# Altium project PROC054D_MMW_CAS_RF_EVM.PrjPcb (part 1 of 9)
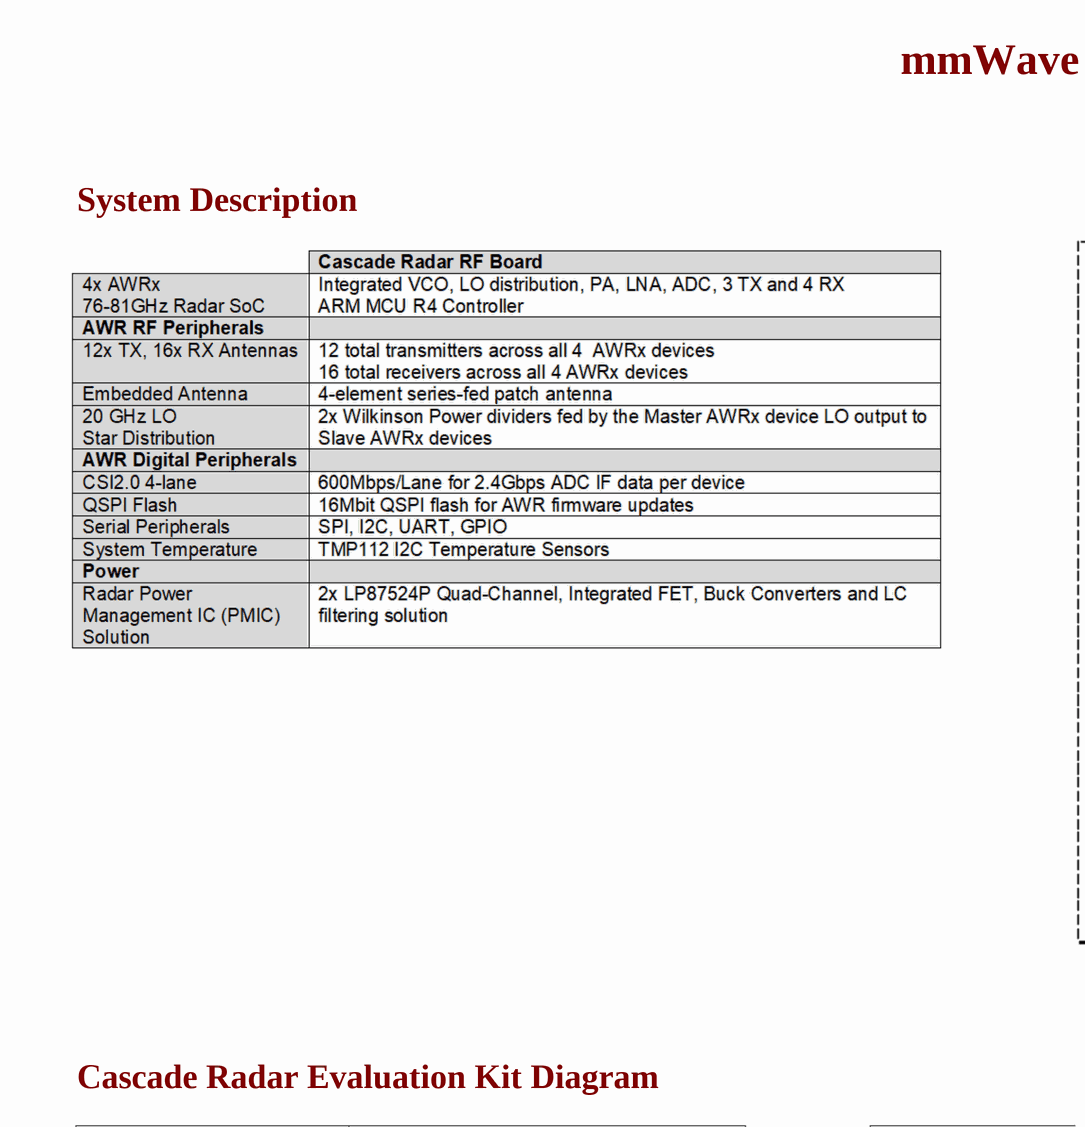
[diagram p0: PROC054D_Coversheet.SchDoc, top left]
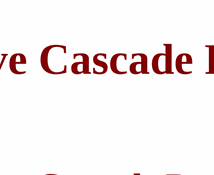
[diagram p1: PROC054D_Coversheet.SchDoc, top right]
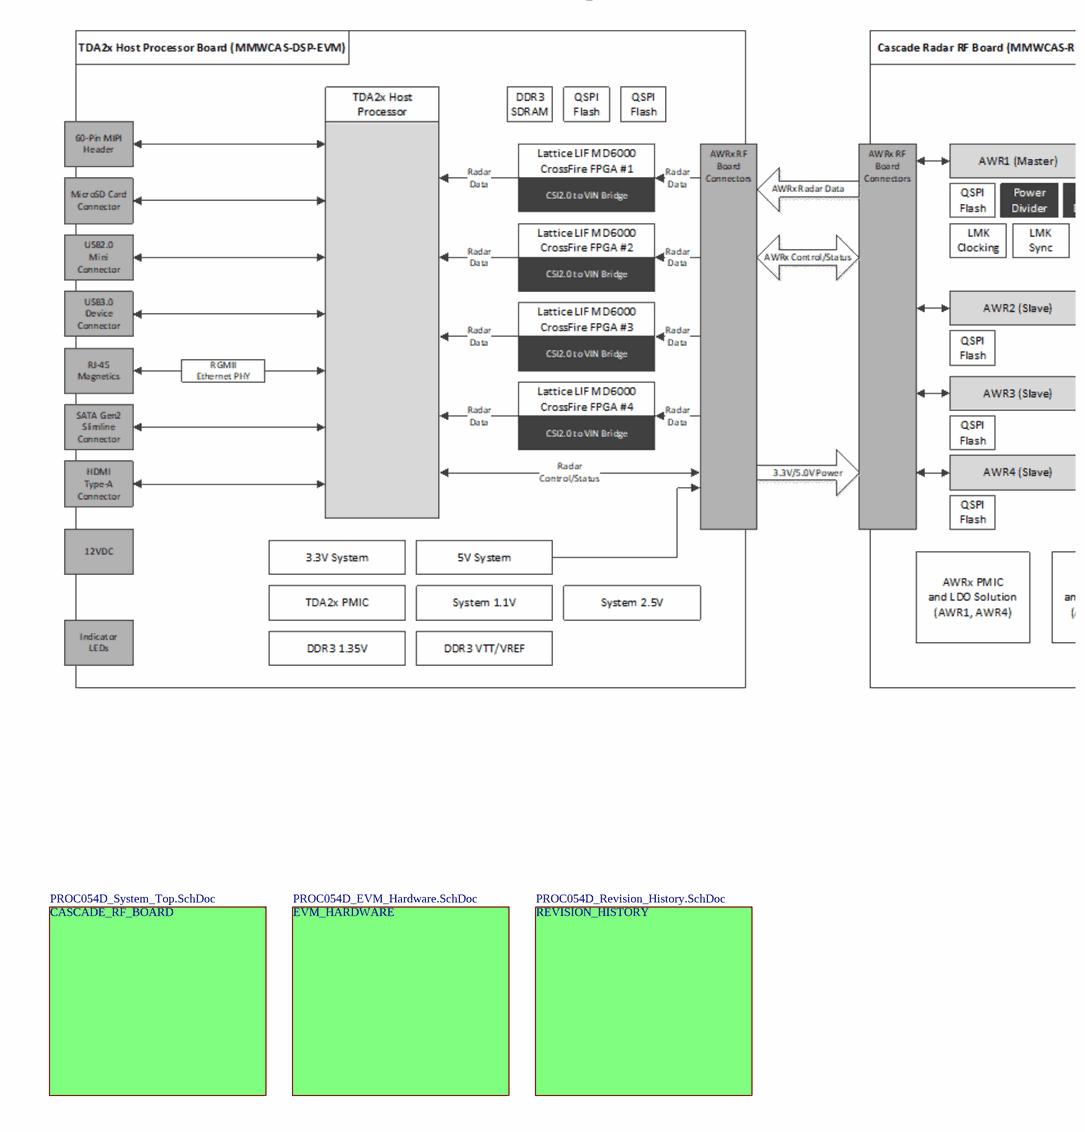
[diagram p2: PROC054D_Coversheet.SchDoc, bottom left]
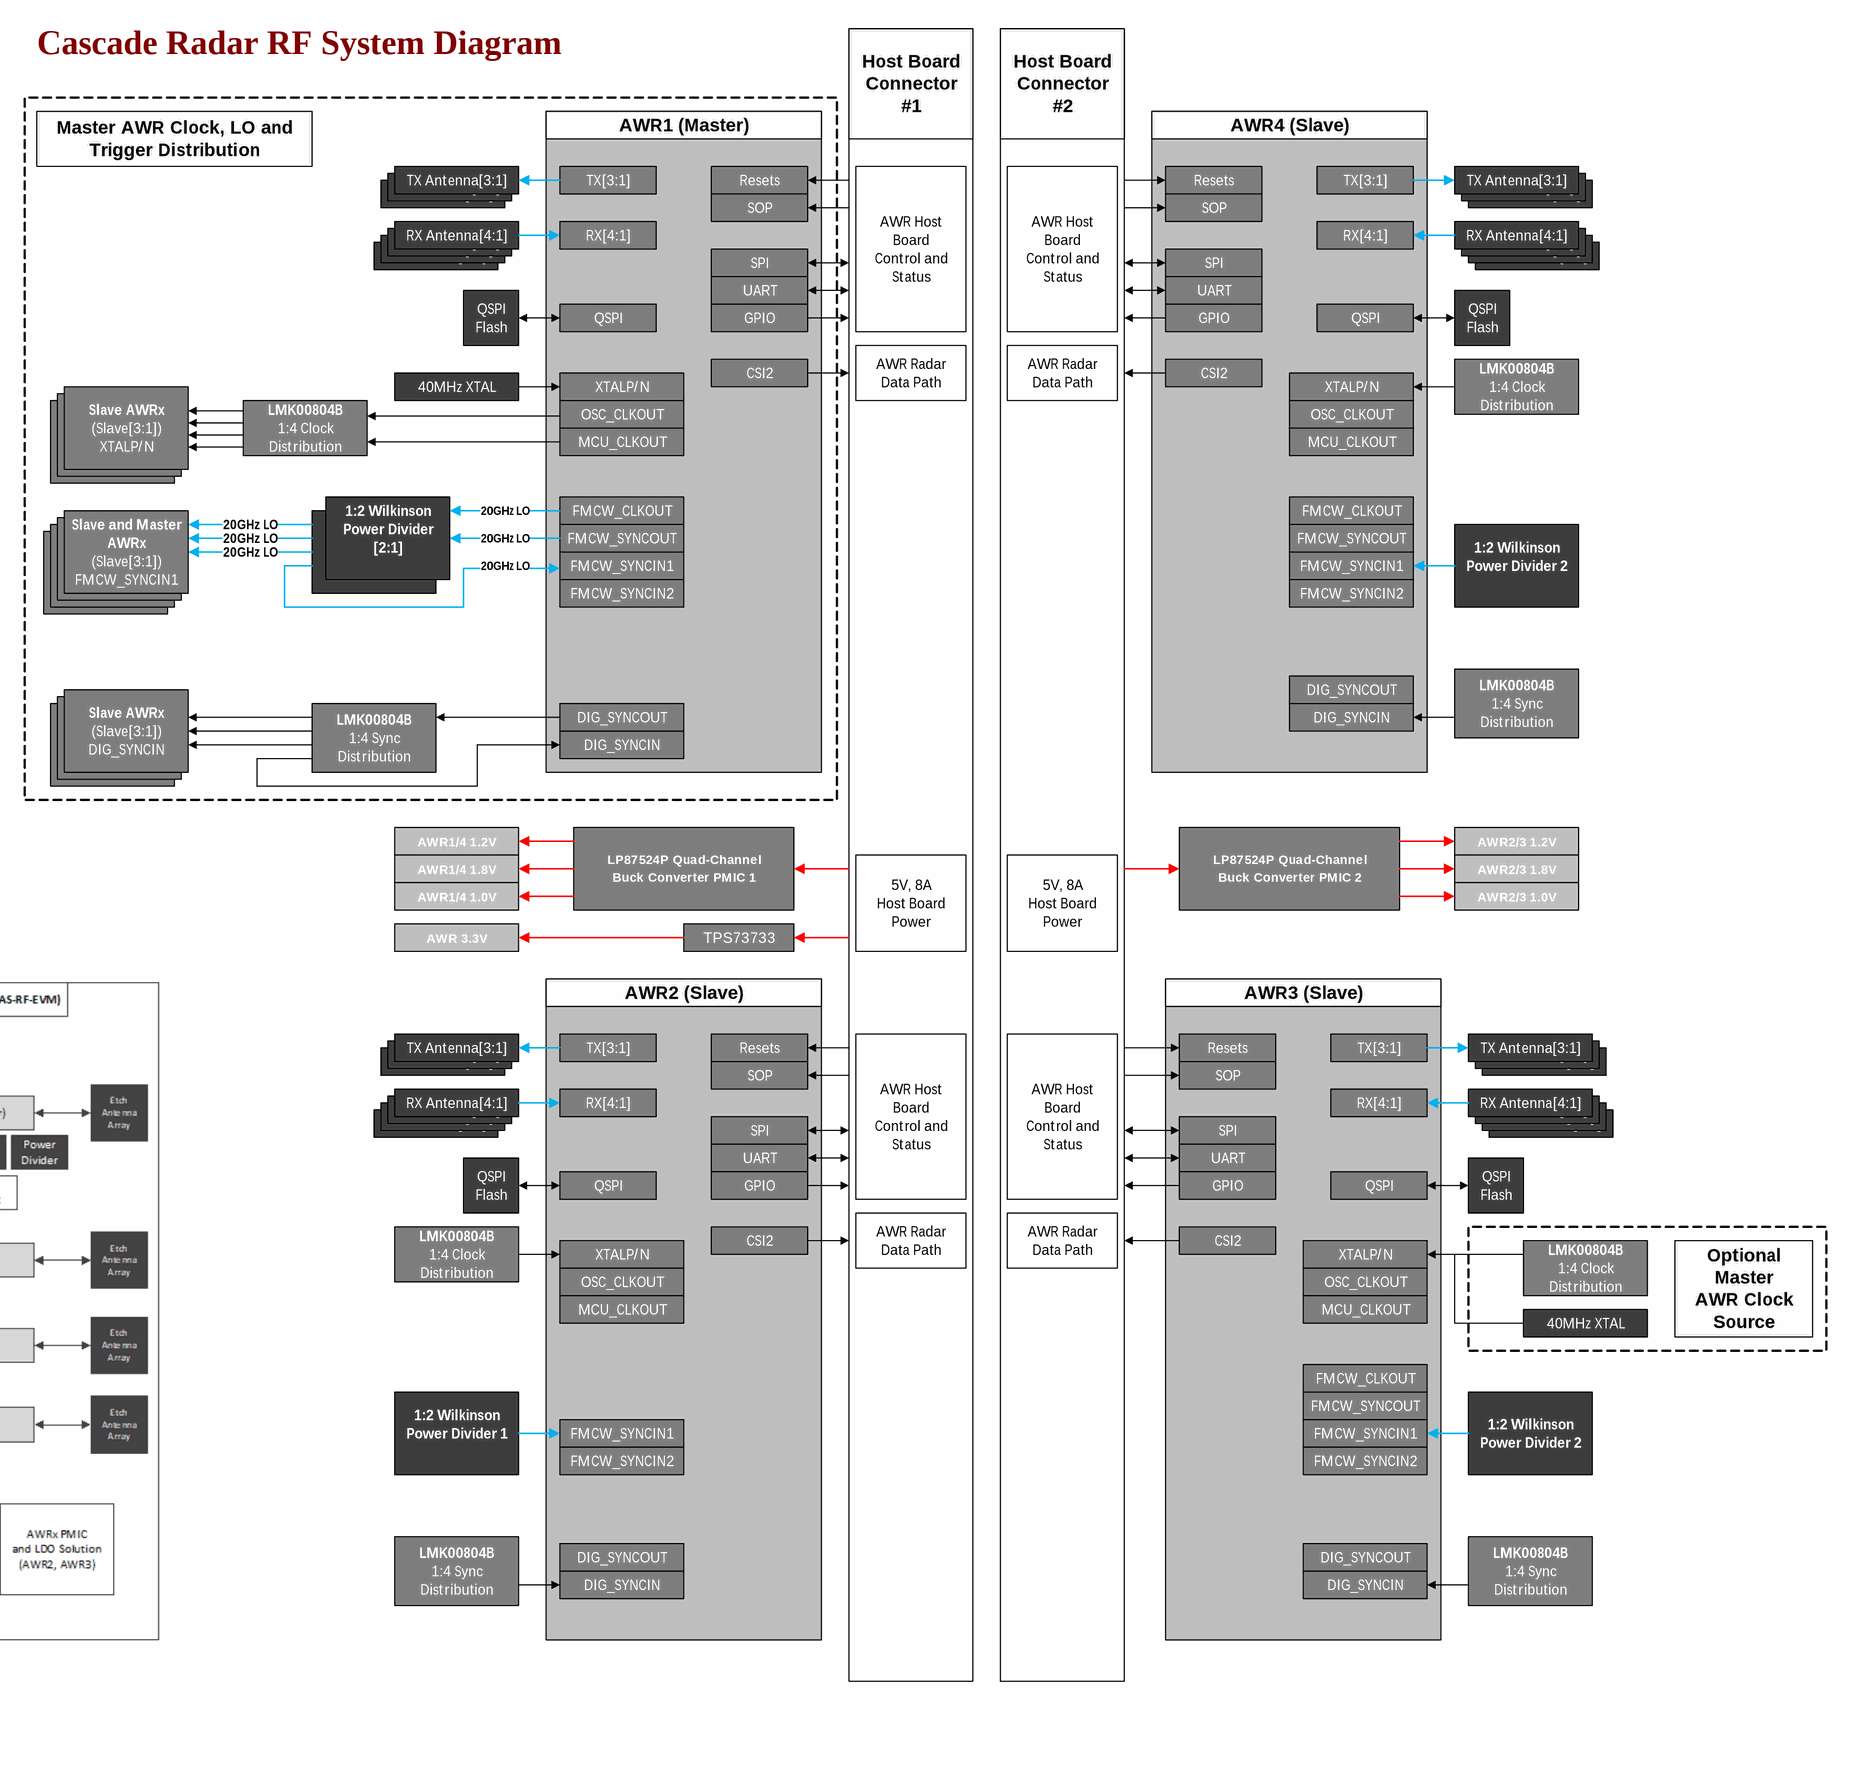
[diagram p3: PROC054D_Coversheet.SchDoc, bottom right]
CopyrightYear: 2020; PCB_Layout: Tessolve/TI; PCB_Rev: D; PRJ_Customer: Public Release; PRJ_Engineer: a0271760; PRJ_Number: PROC054; PRJ_Title: MMWCAS-RF-EVM; SCH_Rev: D; TechSupport: http://www.ti.com/mmwave; TID: N/A
19 sheets, 780 parts. Net scope: flat (ports and power ports of the same name join across sheets).
Board file: PROC054D_MMWCAS_RF_EVM.PcbDoc
Sheets:
  PROC054D_Coversheet.SchDoc
    CASCADE_RF_BOARD = PROC054D_System_Top.SchDoc
      40MHZ_CLOCK = PROC054D_40MHZ_Clock.SchDoc
      DIG_SYNC_LO_20GHZ = PROC054D_FMCW_Sync.SchDoc
      SYSTEM_TEST_CONN_TERMINATION = PROC054D_SMA_SMP_Connectors.SchDoc
      SYSTEM_TEMP_SENSORS = PROC054D_Temp_Sensor.SchDoc
      AWR_1 = PROC054D_AWR_Interfaces.SchDoc
      AWR_1 = PROC054D_AWR_Power_Decoupling.SchDoc
      SYSTEM_POWER = PROC054D_System_Power.SchDoc
        AWR_1_AWR_4_LP87524P = PROC054D_AWR_1_AWR_4_LP87524P.SchDoc
        SYSTEM_3V3_SUPPLY = PROC054D_System_3V3_Supply.SchDoc
        AWR_2_AWR_3_LP87524P = PROC054D_AWR_2_AWR_3_LP87524P.SchDoc
        AWR_1_AWR_4_LC_Filtering = PROC054D_AWR_1_AWR_4_LC_Filtering.SchDoc
        AWR_2_AWR_3_LC_Filtering = PROC054D_AWR_2_AWR_3_LC_Filtering.SchDoc
      SYSTEM_LED_INDICATORS = PROC054D_System_LED.SchDoc
      AWR_1 = PROC054D_AWR_Pull_Resistors.SchDoc
      HOST_CONNECTORS = PROC054D_Host_Connector.SchDoc
      AWR_2 = PROC054D_AWR_Interfaces.SchDoc
      AWR_2 = PROC054D_AWR_Power_Decoupling.SchDoc
      AWR_2 = PROC054D_AWR_Pull_Resistors.SchDoc
      AWR_3 = PROC054D_AWR_Power_Decoupling.SchDoc
      AWR_3 = PROC054D_AWR_Pull_Resistors.SchDoc
      AWR_3 = PROC054D_AWR_Interfaces.SchDoc
      AWR_4 = PROC054D_AWR_Interfaces.SchDoc
      AWR_4 = PROC054D_AWR_Pull_Resistors.SchDoc
      AWR_4 = PROC054D_AWR_Power_Decoupling.SchDoc
    EVM_HARDWARE = PROC054D_EVM_Hardware.SchDoc
    REVISION_HISTORY = PROC054D_Revision_History.SchDoc

## Sheet PROC054D_Coversheet.SchDoc: Coversheet
size 558 x 431 mm; Date: Not shown in title block; ApprovedBy: Not shown in title block; CheckedBy: Not shown in title block; Author: Not shown in title block; CompanyName: Not shown in title block; DrawnBy: a0271760; Engineer: Not shown in title block; Organization: Not shown in title block; Address1: Not shown in title block; Address2: Not shown in title block; Address3: Not shown in title block; Address4: Not shown in title block; DocumentNumber: 1; Revision: Use project parameter SCH_Rev; SheetNumber: 1; SheetTotal: 19; PageSetup: Record=PageOptions|CenterHorizontal=True|CenterVertical=True|PrintScale=1.00|XCorrection=1.00|YCorrection=1.00|PrintKind=0|BorderSize=5000000|LeftOffset=0|BottomOffset=0|Orientation=2|PaperLength=1000|PaperWidth=1000|Scale=100|PaperSource=15|PrintQuality=600|MediaType=1|DitherType=10|PaperKind=Letter|PrintScaleMode=1; CurrentTime: Not shown in title block; CurrentDate: Not shown in title block; Time: Not shown in title block; DocumentFullPathAndName: Not shown in title block; DocumentName: Not shown in title block; ModifiedDate: Not shown in title block; ImagePath: Not shown in title block

### Sub-sheets
CASCADE_RF_BOARD = PROC054D_System_Top.SchDoc: no entries
EVM_HARDWARE = PROC054D_EVM_Hardware.SchDoc: no entries
REVISION_HISTORY = PROC054D_Revision_History.SchDoc: no entries

### Notes on the sheet
- mmWave Cascade Radar RF Board (MMWCAS-RF-EVM)
- Cascade Radar RF System Diagram
- System Description
- Cascade Radar Evaluation Kit Diagram
- Drawn By:
- SVN Rev:
- Number:
- TID #:
- Orderable:
- Rev:
- Sheet Title:
- File:
- Project Title:
- Designed for:
- Assembly Variant:
- Mod. Date:
- Sheet:
- Size:
- of
- C
- http://www.ti.com
- Texas Instruments and/or its licensors do not warrant the accuracy or completeness of this specification or any information contained therein. Texas Instruments and/or its licensors do not warrant that this design will meet the specifications, will be suitable for your application or fit for any particular purpose, or will operate in an implementation. Texas Instruments and/or its licensors do not warrant that the design is production worthy. You should completely validate and test your design implementation to confirm the system functionality for your application.
- Engineer:
- Contact:
- © Texas Instruments

## Sheet PROC054D_System_Top.SchDoc: System Top
size 558 x 431 mm; Date: Not shown in title block; ApprovedBy: Not shown in title block; CheckedBy: Not shown in title block; Author: Not shown in title block; CompanyName: Not shown in title block; DrawnBy: a0271760; Engineer: Not shown in title block; Organization: Not shown in title block; Address1: Not shown in title block; Address2: Not shown in title block; Address3: Not shown in title block; Address4: Not shown in title block; DocumentNumber: 2; Revision: Use project parameter SCH_Rev; SheetNumber: 2; SheetTotal: 19; PageSetup: Record=PageOptions|CenterHorizontal=True|CenterVertical=True|PrintScale=1.00|XCorrection=1.00|YCorrection=1.00|PrintKind=0|BorderSize=5000000|LeftOffset=0|BottomOffset=0|Orientation=2|PaperLength=1000|PaperWidth=1000|Scale=100|PaperSource=15|PrintQuality=600|MediaType=1|DitherType=10|PaperKind=Letter|PrintScaleMode=1; CurrentTime: Not shown in title block; CurrentDate: Not shown in title block; Time: Not shown in title block; DocumentFullPathAndName: Not shown in title block; DocumentName: Not shown in title block; ModifiedDate: Not shown in title block; ImagePath: Not shown in title block
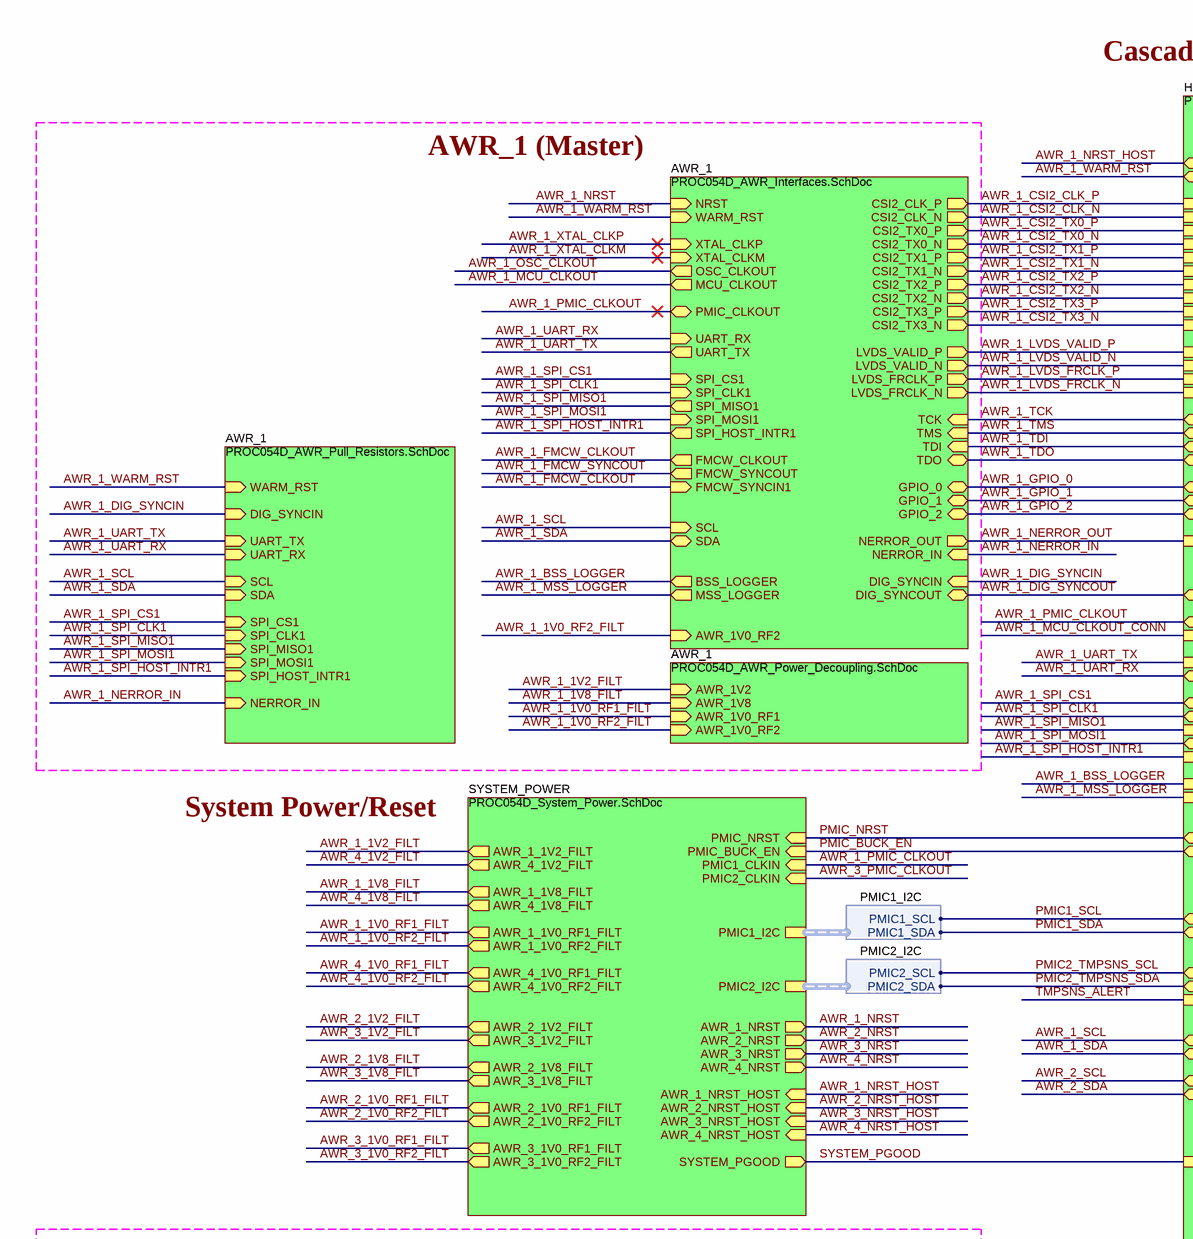
[diagram p4: PROC054D_System_Top.SchDoc, top left]
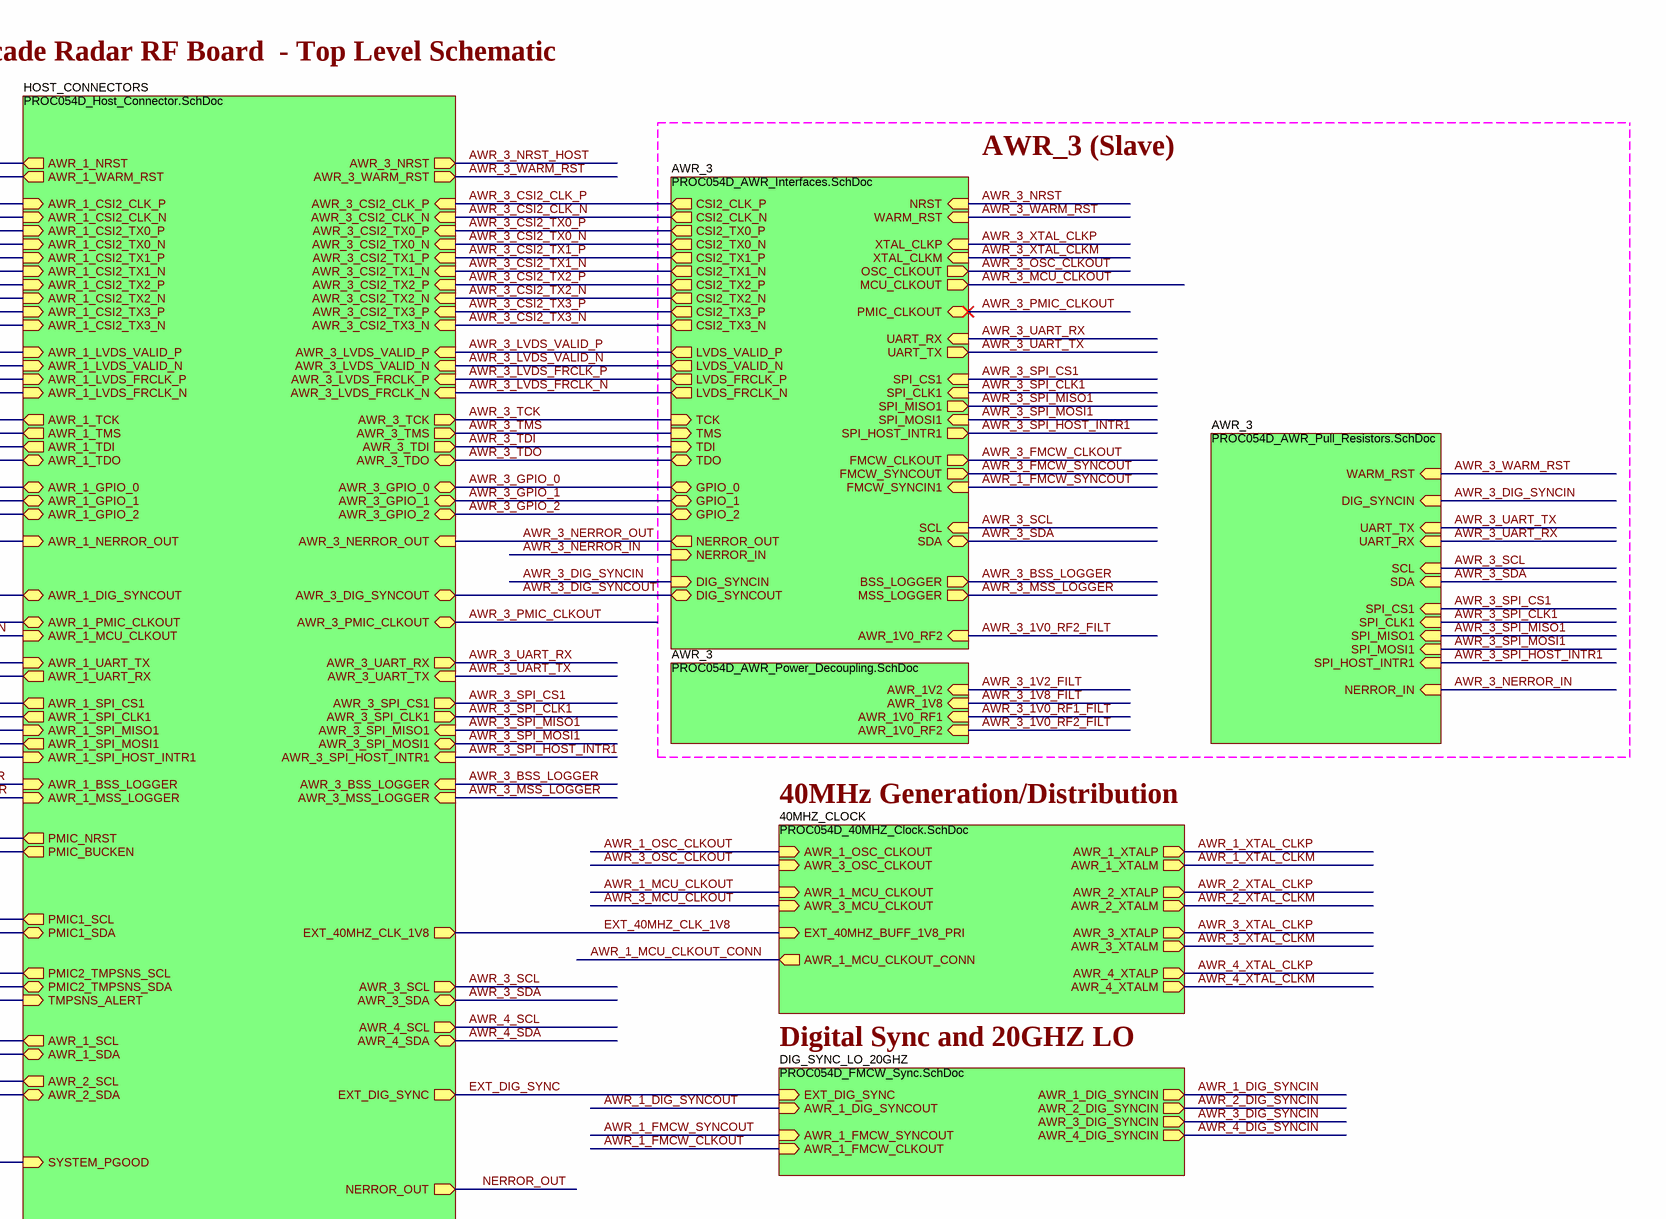
[diagram p5: PROC054D_System_Top.SchDoc, top right]
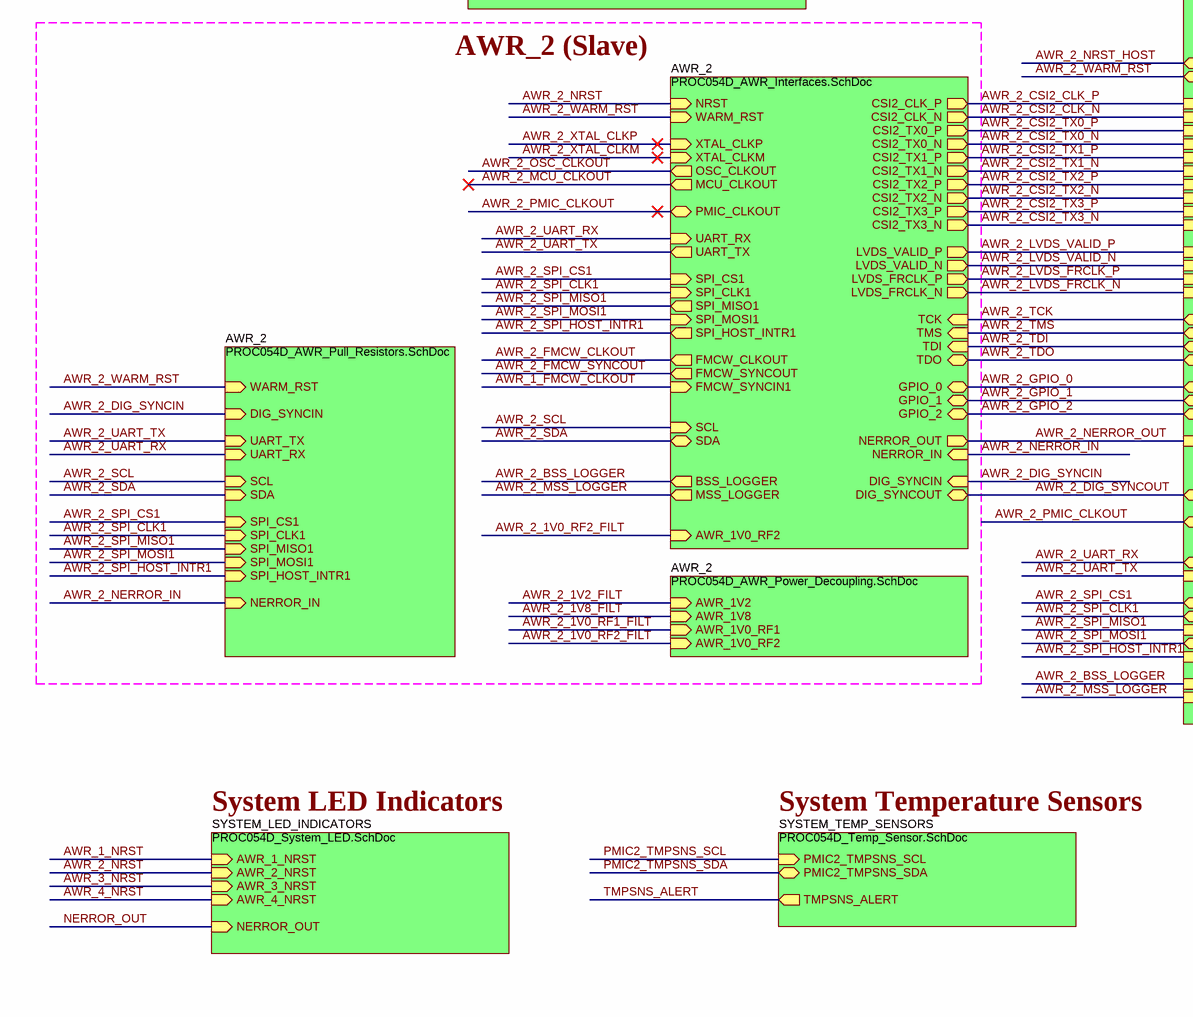
[diagram p6: PROC054D_System_Top.SchDoc, bottom left]
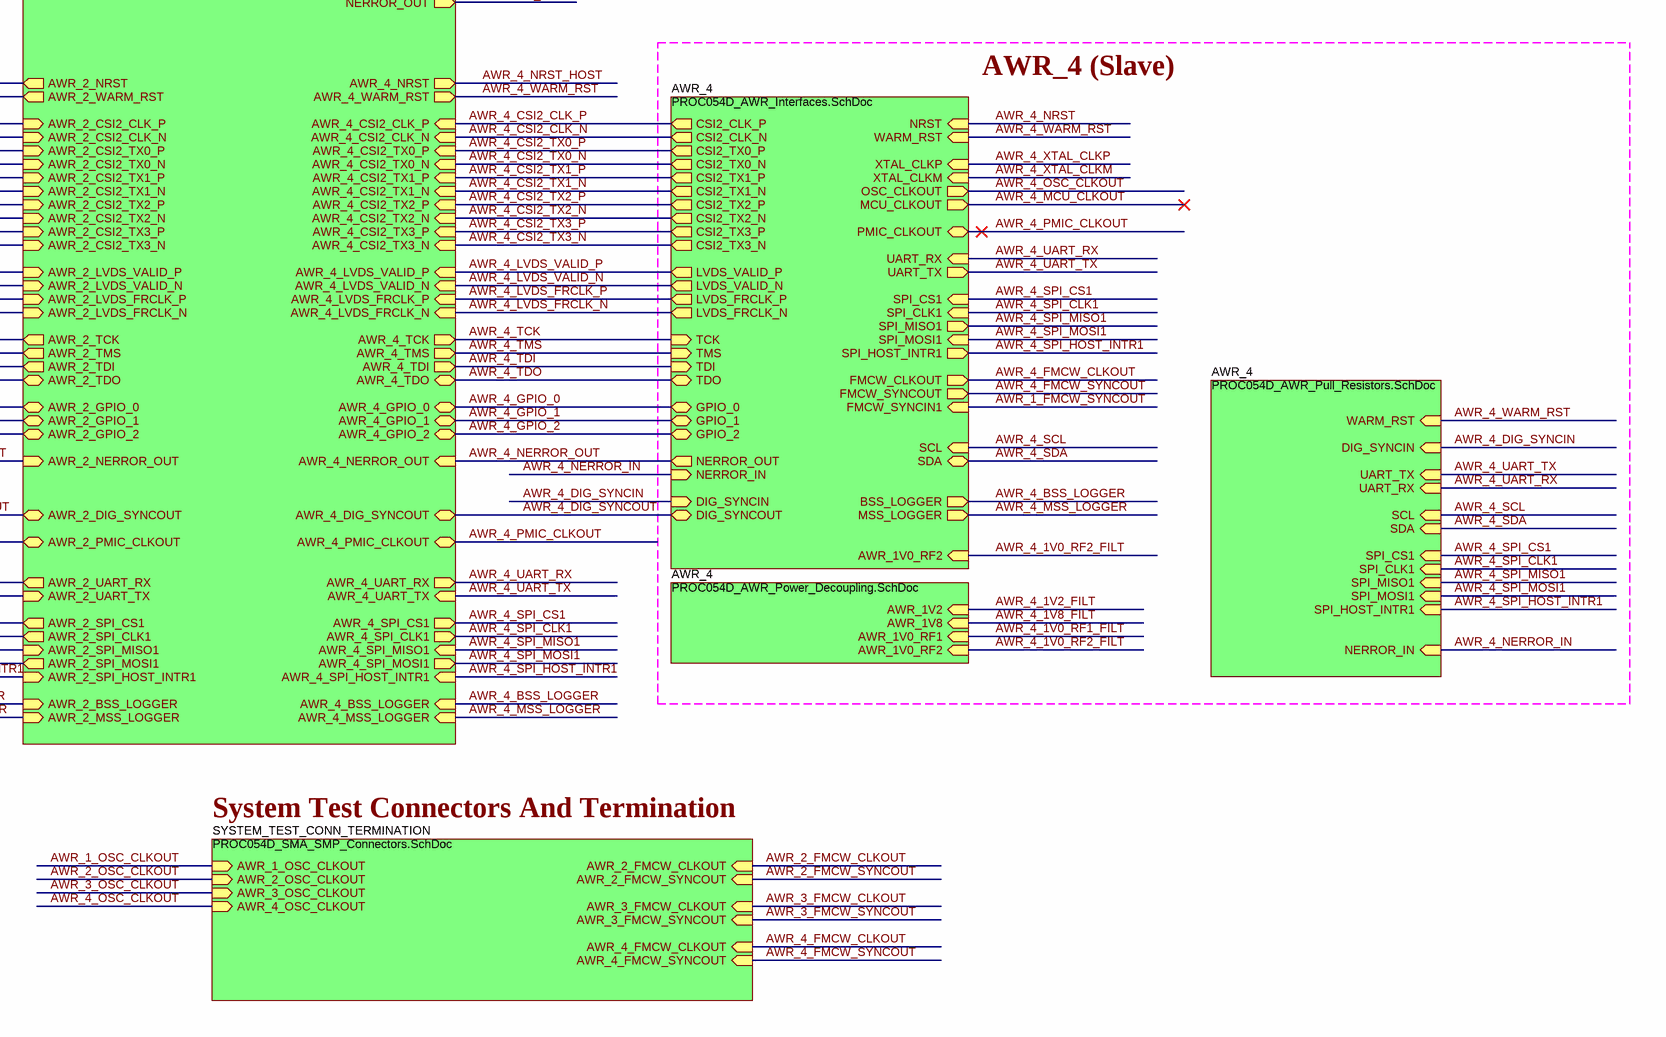
[diagram p7: PROC054D_System_Top.SchDoc, bottom right]

### Sub-sheets
40MHZ_CLOCK = PROC054D_40MHZ_Clock.SchDoc: AWR_4_XTALP (out), AWR_2_XTALP (out), AWR_3_XTALM (out), AWR_3_XTALP (out), AWR_4_XTALM (out), AWR_2_XTALM (out), AWR_1_XTALM (out), AWR_1_XTALP (out), EXT_40MHZ_BUFF_1V8_PRI (in), AWR_3_OSC_CLKOUT (in), AWR_1_MCU_CLKOUT (in), AWR_3_MCU_CLKOUT (in), AWR_1_OSC_CLKOUT (in), AWR_1_MCU_CLKOUT_CONN (out)
AWR_1 = PROC054D_AWR_Interfaces.SchDoc: OSC_CLKOUT (out), PMIC_CLKOUT (bidir), XTAL_CLKP (in), CSI2_TX2_P (out), CSI2_TX2_N (out), CSI2_TX3_P (out), CSI2_TX3_N (out), LVDS_FRCLK_P (out), LVDS_FRCLK_N (out), NERROR_OUT (out), NERROR_IN (in), XTAL_CLKM (in), LVDS_VALID_N (out), WARM_RST (in), NRST (in), CSI2_CLK_P (out), CSI2_CLK_N (out), TCK (in), CSI2_TX1_N (out), TDO (bidir), TMS (in), TDI (in), LVDS_VALID_P (out), CSI2_TX0_N (out), CSI2_TX1_P (out), CSI2_TX0_P (out), MCU_CLKOUT (out), DIG_SYNCOUT (bidir), DIG_SYNCIN (in), GPIO_0 (bidir), GPIO_1 (bidir), GPIO_2 (bidir), UART_RX (in), UART_TX (out), SPI_CLK1 (in), SPI_HOST_INTR1 (out), SPI_CS1 (in), SPI_MOSI1 (in), SPI_MISO1 (out), FMCW_SYNCIN1 (in), FMCW_CLKOUT (out), FMCW_SYNCOUT (out), SCL (in), SDA (bidir), BSS_LOGGER (out), MSS_LOGGER (out), AWR_1V0_RF2 (in)
AWR_1 = PROC054D_AWR_Power_Decoupling.SchDoc: AWR_1V0_RF1 (in), AWR_1V8 (in), AWR_1V2 (in), AWR_1V0_RF2 (in)
AWR_1 = PROC054D_AWR_Pull_Resistors.SchDoc: DIG_SYNCIN (in), SPI_CS1 (in), WARM_RST (in), UART_TX (in), UART_RX (in), SCL (in), SDA (in), SPI_CLK1 (in), SPI_MOSI1 (in), SPI_MISO1 (in), SPI_HOST_INTR1 (in), NERROR_IN (in)
AWR_2 = PROC054D_AWR_Interfaces.SchDoc: OSC_CLKOUT (out), PMIC_CLKOUT (bidir), XTAL_CLKP (in), CSI2_TX2_P (out), CSI2_TX2_N (out), CSI2_TX3_P (out), CSI2_TX3_N (out), LVDS_FRCLK_P (out), LVDS_FRCLK_N (out), NERROR_OUT (out), NERROR_IN (in), XTAL_CLKM (in), LVDS_VALID_N (out), WARM_RST (in), NRST (in), CSI2_CLK_P (out), CSI2_CLK_N (out), TCK (in), CSI2_TX1_N (out), TDO (bidir), TMS (in), TDI (in), LVDS_VALID_P (out), CSI2_TX0_N (out), CSI2_TX1_P (out), CSI2_TX0_P (out), MCU_CLKOUT (out), DIG_SYNCOUT (bidir), DIG_SYNCIN (in), GPIO_0 (bidir), GPIO_1 (bidir), GPIO_2 (bidir), UART_RX (in), UART_TX (out), SPI_CLK1 (in), SPI_HOST_INTR1 (out), SPI_CS1 (in), SPI_MOSI1 (in), SPI_MISO1 (out), FMCW_SYNCIN1 (in), FMCW_CLKOUT (out), FMCW_SYNCOUT (out), SCL (in), SDA (bidir), BSS_LOGGER (out), MSS_LOGGER (out), AWR_1V0_RF2 (in)
AWR_2 = PROC054D_AWR_Power_Decoupling.SchDoc: AWR_1V0_RF1 (in), AWR_1V8 (in), AWR_1V2 (in), AWR_1V0_RF2 (in)
AWR_2 = PROC054D_AWR_Pull_Resistors.SchDoc: DIG_SYNCIN (in), SPI_CS1 (in), WARM_RST (in), UART_TX (in), UART_RX (in), SCL (in), SDA (in), SPI_CLK1 (in), SPI_MOSI1 (in), SPI_MISO1 (in), SPI_HOST_INTR1 (in), NERROR_IN (in)
AWR_3 = PROC054D_AWR_Power_Decoupling.SchDoc: AWR_1V0_RF1 (in), AWR_1V8 (in), AWR_1V2 (in), AWR_1V0_RF2 (in)
AWR_3 = PROC054D_AWR_Pull_Resistors.SchDoc: DIG_SYNCIN (in), SPI_CS1 (in), WARM_RST (in), UART_TX (in), UART_RX (in), SCL (in), SDA (in), SPI_CLK1 (in), SPI_MOSI1 (in), SPI_MISO1 (in), SPI_HOST_INTR1 (in), NERROR_IN (in)
AWR_3 = PROC054D_AWR_Interfaces.SchDoc: OSC_CLKOUT (out), PMIC_CLKOUT (bidir), XTAL_CLKP (in), CSI2_TX2_P (out), CSI2_TX2_N (out), CSI2_TX3_P (out), CSI2_TX3_N (out), LVDS_FRCLK_P (out), LVDS_FRCLK_N (out), NERROR_OUT (out), NERROR_IN (in), XTAL_CLKM (in), LVDS_VALID_N (out), WARM_RST (in), NRST (in), CSI2_CLK_P (out), CSI2_CLK_N (out), TCK (in), CSI2_TX1_N (out), TDO (bidir), TMS (in), TDI (in), LVDS_VALID_P (out), CSI2_TX0_N (out), CSI2_TX1_P (out), CSI2_TX0_P (out), MCU_CLKOUT (out), DIG_SYNCOUT (bidir), DIG_SYNCIN (in), GPIO_0 (bidir), GPIO_1 (bidir), GPIO_2 (bidir), UART_RX (in), UART_TX (out), SPI_CLK1 (in), SPI_HOST_INTR1 (out), SPI_CS1 (in), SPI_MOSI1 (in), SPI_MISO1 (out), FMCW_SYNCIN1 (in), FMCW_CLKOUT (out), FMCW_SYNCOUT (out), SCL (in), SDA (bidir), BSS_LOGGER (out), MSS_LOGGER (out), AWR_1V0_RF2 (in)
AWR_4 = PROC054D_AWR_Interfaces.SchDoc: OSC_CLKOUT (out), PMIC_CLKOUT (bidir), XTAL_CLKP (in), CSI2_TX2_P (out), CSI2_TX2_N (out), CSI2_TX3_P (out), CSI2_TX3_N (out), LVDS_FRCLK_P (out), LVDS_FRCLK_N (out), NERROR_OUT (out), NERROR_IN (in), XTAL_CLKM (in), LVDS_VALID_N (out), WARM_RST (in), NRST (in), CSI2_CLK_P (out), CSI2_CLK_N (out), TCK (in), CSI2_TX1_N (out), TDO (bidir), TMS (in), TDI (in), LVDS_VALID_P (out), CSI2_TX0_N (out), CSI2_TX1_P (out), CSI2_TX0_P (out), MCU_CLKOUT (out), DIG_SYNCOUT (bidir), DIG_SYNCIN (in), GPIO_0 (bidir), GPIO_1 (bidir), GPIO_2 (bidir), UART_RX (in), UART_TX (out), SPI_CLK1 (in), SPI_HOST_INTR1 (out), SPI_CS1 (in), SPI_MOSI1 (in), SPI_MISO1 (out), FMCW_SYNCIN1 (in), FMCW_CLKOUT (out), FMCW_SYNCOUT (out), SCL (in), SDA (bidir), BSS_LOGGER (out), MSS_LOGGER (out), AWR_1V0_RF2 (in)
AWR_4 = PROC054D_AWR_Pull_Resistors.SchDoc: DIG_SYNCIN (in), SPI_CS1 (in), WARM_RST (in), UART_TX (in), UART_RX (in), SCL (in), SDA (in), SPI_CLK1 (in), SPI_MOSI1 (in), SPI_MISO1 (in), SPI_HOST_INTR1 (in), NERROR_IN (in)
AWR_4 = PROC054D_AWR_Power_Decoupling.SchDoc: AWR_1V0_RF1 (in), AWR_1V8 (in), AWR_1V2 (in), AWR_1V0_RF2 (in)
DIG_SYNC_LO_20GHZ = PROC054D_FMCW_Sync.SchDoc: AWR_2_DIG_SYNCIN (out), AWR_4_DIG_SYNCIN (out), EXT_DIG_SYNC (in), AWR_1_DIG_SYNCOUT (in), AWR_1_DIG_SYNCIN (out), AWR_3_DIG_SYNCIN (out), AWR_1_FMCW_SYNCOUT (in), AWR_1_FMCW_CLKOUT (in)
HOST_CONNECTORS = PROC054D_Host_Connector.SchDoc: AWR_1_GPIO_2 (bidir), AWR_1_GPIO_1 (bidir), AWR_1_GPIO_0 (bidir), AWR_1_CSI2_TX0_N (in), AWR_1_TDO (bidir), AWR_1_DIG_SYNCOUT (bidir), AWR_1_CSI2_CLK_N (in), AWR_1_CSI2_TX1_N (in), AWR_1_CSI2_TX0_P (in), AWR_1_CSI2_TX1_P (in), AWR_1_CSI2_TX2_N (in), AWR_1_CSI2_CLK_P (in), AWR_1_CSI2_TX2_P (in), AWR_1_CSI2_TX3_N (in), AWR_1_CSI2_TX3_P (in), AWR_1_LVDS_FRCLK_P (in), AWR_1_LVDS_FRCLK_N (in), AWR_1_LVDS_VALID_N (in), AWR_1_LVDS_VALID_P (in), AWR_1_MCU_CLKOUT (in), AWR_1_UART_RX (out), AWR_1_TMS (out), AWR_1_TDI (out), AWR_1_WARM_RST (out), AWR_1_TCK (out), AWR_1_NRST (out), AWR_1_UART_TX (in), AWR_1_NERROR_OUT (in), AWR_1_PMIC_CLKOUT (bidir), AWR_2_TDI (out), AWR_2_TMS (out), AWR_2_TCK (out), AWR_2_WARM_RST (out), AWR_2_NRST (out), AWR_2_GPIO_1 (bidir), AWR_2_GPIO_0 (bidir), AWR_2_BSS_LOGGER (in), AWR_2_MSS_LOGGER (in), AWR_2_GPIO_2 (bidir), AWR_2_UART_TX (in), AWR_2_UART_RX (out), AWR_2_SPI_CLK1 (out), AWR_2_SPI_MOSI1 (out), AWR_2_SPI_CS1 (out), AWR_2_SPI_HOST_INTR1 (in), AWR_2_NERROR_OUT (in), AWR_2_TDO (bidir), AWR_2_SPI_MISO1 (in), AWR_2_PMIC_CLKOUT (bidir), AWR_2_DIG_SYNCOUT (bidir), AWR_2_CSI2_TX3_P (in), AWR_2_CSI2_TX2_N (in), AWR_2_CSI2_TX0_P (in), AWR_2_CSI2_TX2_P (in), AWR_2_CSI2_TX3_N (in), AWR_2_CSI2_CLK_N (in), AWR_2_LVDS_FRCLK_N (in), AWR_2_CSI2_CLK_P (in), AWR_2_LVDS_FRCLK_P (in), AWR_2_LVDS_VALID_N (in), AWR_2_LVDS_VALID_P (in), AWR_2_CSI2_TX0_N (in), AWR_2_CSI2_TX1_P (in), AWR_2_CSI2_TX1_N (in), AWR_1_SPI_CLK1 (out), AWR_1_SPI_MOSI1 (out), AWR_1_SPI_CS1 (out), AWR_1_SPI_HOST_INTR1 (in), AWR_1_BSS_LOGGER (in), AWR_1_SPI_MISO1 (in), AWR_1_MSS_LOGGER (in), AWR_3_NRST (out), AWR_3_TCK (out), AWR_3_CSI2_TX3_P (in), AWR_3_LVDS_FRCLK_N (in), AWR_3_LVDS_FRCLK_P (in), AWR_3_GPIO_1 (bidir), AWR_3_WARM_RST (out), AWR_3_UART_RX (out), AWR_3_UART_TX (in), AWR_3_BSS_LOGGER (in), AWR_3_TMS (out), AWR_3_CSI2_TX1_P (in), AWR_3_CSI2_TX1_N (in), AWR_3_TDI (out), AWR_3_PMIC_CLKOUT (bidir), AWR_3_DIG_SYNCOUT (bidir), AWR_3_CSI2_TX2_N (in), AWR_3_CSI2_TX0_N (in), AWR_3_CSI2_TX0_P (in), AWR_3_CSI2_CLK_P (in), AWR_3_CSI2_CLK_N (in), AWR_3_GPIO_0 (bidir), AWR_3_GPIO_2 (bidir), AWR_3_CSI2_TX3_N (in), AWR_3_MSS_LOGGER (in), AWR_3_SPI_MISO1 (in), AWR_3_SPI_HOST_INTR1 (in), AWR_3_SPI_CS1 (out), AWR_3_SPI_MOSI1 (bidir), AWR_3_CSI2_TX2_P (in), AWR_3_LVDS_VALID_P (in), AWR_3_LVDS_VALID_N (in), AWR_3_TDO (bidir), AWR_3_NERROR_OUT (in), AWR_3_SPI_CLK1 (out), AWR_4_GPIO_2 (bidir), AWR_4_GPIO_0 (bidir), AWR_4_GPIO_1 (bidir), AWR_4_CSI2_CLK_N (in), AWR_4_CSI2_CLK_P (in), AWR_4_DIG_SYNCOUT (bidir), AWR_4_PMIC_CLKOUT (bidir), AWR_4_TDO (bidir), AWR_4_NERROR_OUT (in), AWR_4_CSI2_TX3_P (in), AWR_4_CSI2_TX3_N (in), AWR_4_CSI2_TX2_N (in), AWR_4_LVDS_FRCLK_N (in), AWR_4_CSI2_TX2_P (in), AWR_4_LVDS_FRCLK_P (in), AWR_4_LVDS_VALID_N (in), AWR_4_LVDS_VALID_P (in), AWR_4_SPI_MISO1 (in), AWR_4_CSI2_TX0_N (in), AWR_4_SPI_HOST_INTR1 (in), AWR_4_SPI_CS1 (out), AWR_4_SPI_CLK1 (out), AWR_4_SPI_MOSI1 (out), AWR_4_UART_RX (out), AWR_4_MSS_LOGGER (in), AWR_4_UART_TX (in), AWR_4_BSS_LOGGER (in), AWR_4_CSI2_TX0_P (in), AWR_4_CSI2_TX1_P (in), AWR_4_CSI2_TX1_N (in), AWR_4_NRST (out), AWR_4_TDI (out), AWR_4_TMS (out), AWR_4_WARM_RST (out), AWR_4_TCK (out), PMIC2_TMPSNS_SDA (bidir), PMIC_NRST (out), TMPSNS_ALERT (in), PMIC_BUCKEN (out), EXT_40MHZ_CLK_1V8 (out), PMIC2_TMPSNS_SCL (out), EXT_DIG_SYNC (out), PMIC1_SCL (out), PMIC1_SDA (bidir), SYSTEM_PGOOD (in), AWR_1_SCL (out), AWR_1_SDA (bidir), AWR_2_SCL (out), AWR_2_SDA (bidir), AWR_3_SCL (out), AWR_3_SDA (bidir), AWR_4_SCL (out), AWR_4_SDA (bidir), NERROR_OUT (out)
SYSTEM_LED_INDICATORS = PROC054D_System_LED.SchDoc: AWR_4_NRST (in), AWR_2_NRST (in), AWR_1_NRST (in), AWR_3_NRST (in), NERROR_OUT (in)
SYSTEM_POWER = PROC054D_System_Power.SchDoc: PMIC_BUCK_EN (in), PMIC_NRST (in), PMIC2_CLKIN (in), PMIC1_CLKIN (in), SYSTEM_PGOOD (out), AWR_1_NRST (out), AWR_2_NRST (out), AWR_3_NRST (out), AWR_4_NRST (out), PMIC1_I2C (harness PMIC1_I2C), PMIC2_I2C (harness PMIC2_I2C), AWR_4_NRST_HOST (in), AWR_3_NRST_HOST (in), AWR_1_NRST_HOST (in), AWR_2_NRST_HOST (in), AWR_1_1V2_FILT (out), AWR_4_1V2_FILT (out), AWR_1_1V8_FILT (out), AWR_4_1V8_FILT (out), AWR_4_1V0_RF2_FILT (out), AWR_1_1V0_RF1_FILT (out), AWR_1_1V0_RF2_FILT (out), AWR_4_1V0_RF1_FILT (out), AWR_2_1V2_FILT (out), AWR_3_1V2_FILT (out), AWR_2_1V8_FILT (out), AWR_3_1V8_FILT (out), AWR_2_1V0_RF1_FILT (out), AWR_3_1V0_RF1_FILT (out), AWR_2_1V0_RF2_FILT (out), AWR_3_1V0_RF2_FILT (out)
SYSTEM_TEMP_SENSORS = PROC054D_Temp_Sensor.SchDoc: PMIC2_TMPSNS_SDA (bidir), TMPSNS_ALERT (out), PMIC2_TMPSNS_SCL (in)
SYSTEM_TEST_CONN_TERMINATION = PROC054D_SMA_SMP_Connectors.SchDoc: AWR_1_OSC_CLKOUT (in), AWR_3_OSC_CLKOUT (in), AWR_4_OSC_CLKOUT (in), AWR_2_OSC_CLKOUT (in), AWR_3_FMCW_CLKOUT (in), AWR_2_FMCW_CLKOUT (in), AWR_4_FMCW_CLKOUT (in), AWR_2_FMCW_SYNCOUT (in), AWR_3_FMCW_SYNCOUT (in), AWR_4_FMCW_SYNCOUT (in)

### Harnesses
PMIC1_I2C: PMIC1_SCL, PMIC1_SDA
PMIC2_I2C: PMIC2_SCL, PMIC2_SDA

### Nets
AWR_1_1V0_RF1_FILT: sheet AWR_1/AWR_1V0_RF1, sheet SYSTEM_POWER/AWR_1_1V0_RF1_FILT
AWR_1_1V0_RF2_FILT: sheet AWR_1/AWR_1V0_RF2, sheet AWR_1/AWR_1V0_RF2, sheet SYSTEM_POWER/AWR_1_1V0_RF2_FILT
AWR_1_1V2_FILT: sheet AWR_1/AWR_1V2, sheet SYSTEM_POWER/AWR_1_1V2_FILT
AWR_1_1V8_FILT: sheet AWR_1/AWR_1V8, sheet SYSTEM_POWER/AWR_1_1V8_FILT
AWR_1_BSS_LOGGER: sheet AWR_1/BSS_LOGGER, sheet HOST_CONNECTORS/AWR_1_BSS_LOGGER
AWR_1_CSI2_CLK_N: sheet AWR_1/CSI2_CLK_N, sheet HOST_CONNECTORS/AWR_1_CSI2_CLK_N
AWR_1_CSI2_CLK_P: sheet AWR_1/CSI2_CLK_P, sheet HOST_CONNECTORS/AWR_1_CSI2_CLK_P
AWR_1_CSI2_TX0_N: sheet AWR_1/CSI2_TX0_N, sheet HOST_CONNECTORS/AWR_1_CSI2_TX0_N
AWR_1_CSI2_TX0_P: sheet AWR_1/CSI2_TX0_P, sheet HOST_CONNECTORS/AWR_1_CSI2_TX0_P
AWR_1_CSI2_TX1_N: sheet AWR_1/CSI2_TX1_N, sheet HOST_CONNECTORS/AWR_1_CSI2_TX1_N
AWR_1_CSI2_TX1_P: sheet AWR_1/CSI2_TX1_P, sheet HOST_CONNECTORS/AWR_1_CSI2_TX1_P
AWR_1_CSI2_TX2_N: sheet AWR_1/CSI2_TX2_N, sheet HOST_CONNECTORS/AWR_1_CSI2_TX2_N
AWR_1_CSI2_TX2_P: sheet AWR_1/CSI2_TX2_P, sheet HOST_CONNECTORS/AWR_1_CSI2_TX2_P
AWR_1_CSI2_TX3_N: sheet AWR_1/CSI2_TX3_N, sheet HOST_CONNECTORS/AWR_1_CSI2_TX3_N
AWR_1_CSI2_TX3_P: sheet AWR_1/CSI2_TX3_P, sheet HOST_CONNECTORS/AWR_1_CSI2_TX3_P
AWR_1_DIG_SYNCIN: sheet DIG_SYNC_LO_20GHZ/AWR_1_DIG_SYNCIN, sheet AWR_1/DIG_SYNCIN, sheet AWR_1/DIG_SYNCIN
AWR_1_DIG_SYNCOUT: sheet DIG_SYNC_LO_20GHZ/AWR_1_DIG_SYNCOUT, sheet AWR_1/DIG_SYNCOUT, sheet HOST_CONNECTORS/AWR_1_DIG_SYNCOUT
AWR_1_FMCW_CLKOUT: sheet DIG_SYNC_LO_20GHZ/AWR_1_FMCW_CLKOUT, sheet AWR_1/FMCW_SYNCIN1, sheet AWR_1/FMCW_CLKOUT, sheet AWR_2/FMCW_SYNCIN1
AWR_1_FMCW_SYNCOUT: sheet DIG_SYNC_LO_20GHZ/AWR_1_FMCW_SYNCOUT, sheet AWR_1/FMCW_SYNCOUT, sheet AWR_3/FMCW_SYNCIN1, sheet AWR_4/FMCW_SYNCIN1
AWR_1_GPIO_0: sheet AWR_1/GPIO_0, sheet HOST_CONNECTORS/AWR_1_GPIO_0
AWR_1_GPIO_1: sheet AWR_1/GPIO_1, sheet HOST_CONNECTORS/AWR_1_GPIO_1
AWR_1_GPIO_2: sheet AWR_1/GPIO_2, sheet HOST_CONNECTORS/AWR_1_GPIO_2
AWR_1_LVDS_FRCLK_N: sheet AWR_1/LVDS_FRCLK_N, sheet HOST_CONNECTORS/AWR_1_LVDS_FRCLK_N
AWR_1_LVDS_FRCLK_P: sheet AWR_1/LVDS_FRCLK_P, sheet HOST_CONNECTORS/AWR_1_LVDS_FRCLK_P
AWR_1_LVDS_VALID_N: sheet AWR_1/LVDS_VALID_N, sheet HOST_CONNECTORS/AWR_1_LVDS_VALID_N
AWR_1_LVDS_VALID_P: sheet AWR_1/LVDS_VALID_P, sheet HOST_CONNECTORS/AWR_1_LVDS_VALID_P
AWR_1_MCU_CLKOUT: sheet 40MHZ_CLOCK/AWR_1_MCU_CLKOUT, sheet AWR_1/MCU_CLKOUT
AWR_1_MCU_CLKOUT_CONN: sheet 40MHZ_CLOCK/AWR_1_MCU_CLKOUT_CONN, sheet HOST_CONNECTORS/AWR_1_MCU_CLKOUT
AWR_1_MSS_LOGGER: sheet AWR_1/MSS_LOGGER, sheet HOST_CONNECTORS/AWR_1_MSS_LOGGER
AWR_1_NERROR_IN: sheet AWR_1/NERROR_IN, sheet AWR_1/NERROR_IN
AWR_1_NERROR_OUT: sheet AWR_1/NERROR_OUT, sheet HOST_CONNECTORS/AWR_1_NERROR_OUT
AWR_1_NRST: sheet AWR_1/NRST, sheet SYSTEM_POWER/AWR_1_NRST, sheet SYSTEM_LED_INDICATORS/AWR_1_NRST
AWR_1_NRST_HOST: sheet SYSTEM_POWER/AWR_1_NRST_HOST, sheet HOST_CONNECTORS/AWR_1_NRST
AWR_1_OSC_CLKOUT: sheet 40MHZ_CLOCK/AWR_1_OSC_CLKOUT, sheet SYSTEM_TEST_CONN_TERMINATION/AWR_1_OSC_CLKOUT, sheet AWR_1/OSC_CLKOUT
AWR_1_PMIC_CLKOUT: sheet AWR_1/PMIC_CLKOUT, sheet SYSTEM_POWER/PMIC1_CLKIN, sheet HOST_CONNECTORS/AWR_1_PMIC_CLKOUT
AWR_1_SCL: sheet AWR_1/SCL, sheet AWR_1/SCL, sheet HOST_CONNECTORS/AWR_1_SCL
AWR_1_SDA: sheet AWR_1/SDA, sheet AWR_1/SDA, sheet HOST_CONNECTORS/AWR_1_SDA
AWR_1_SPI_CLK1: sheet AWR_1/SPI_CLK1, sheet AWR_1/SPI_CLK1, sheet HOST_CONNECTORS/AWR_1_SPI_CLK1
AWR_1_SPI_CS1: sheet AWR_1/SPI_CS1, sheet AWR_1/SPI_CS1, sheet HOST_CONNECTORS/AWR_1_SPI_CS1
AWR_1_SPI_HOST_INTR1: sheet AWR_1/SPI_HOST_INTR1, sheet AWR_1/SPI_HOST_INTR1, sheet HOST_CONNECTORS/AWR_1_SPI_HOST_INTR1
AWR_1_SPI_MISO1: sheet AWR_1/SPI_MISO1, sheet AWR_1/SPI_MISO1, sheet HOST_CONNECTORS/AWR_1_SPI_MISO1
AWR_1_SPI_MOSI1: sheet AWR_1/SPI_MOSI1, sheet AWR_1/SPI_MOSI1, sheet HOST_CONNECTORS/AWR_1_SPI_MOSI1
AWR_1_TCK: sheet AWR_1/TCK, sheet HOST_CONNECTORS/AWR_1_TCK
AWR_1_TDI: sheet AWR_1/TDI, sheet HOST_CONNECTORS/AWR_1_TDI
AWR_1_TDO: sheet AWR_1/TDO, sheet HOST_CONNECTORS/AWR_1_TDO
AWR_1_TMS: sheet AWR_1/TMS, sheet HOST_CONNECTORS/AWR_1_TMS
AWR_1_UART_RX: sheet AWR_1/UART_RX, sheet AWR_1/UART_RX, sheet HOST_CONNECTORS/AWR_1_UART_RX
AWR_1_UART_TX: sheet AWR_1/UART_TX, sheet AWR_1/UART_TX, sheet HOST_CONNECTORS/AWR_1_UART_TX
AWR_1_WARM_RST: sheet AWR_1/WARM_RST, sheet AWR_1/WARM_RST, sheet HOST_CONNECTORS/AWR_1_WARM_RST
AWR_1_XTAL_CLKM: sheet 40MHZ_CLOCK/AWR_1_XTALM, sheet AWR_1/XTAL_CLKM
AWR_1_XTAL_CLKP: sheet 40MHZ_CLOCK/AWR_1_XTALP, sheet AWR_1/XTAL_CLKP
AWR_2_1V0_RF1_FILT: sheet SYSTEM_POWER/AWR_2_1V0_RF1_FILT, sheet AWR_2/AWR_1V0_RF1
AWR_2_1V0_RF2_FILT: sheet SYSTEM_POWER/AWR_2_1V0_RF2_FILT, sheet AWR_2/AWR_1V0_RF2, sheet AWR_2/AWR_1V0_RF2
AWR_2_1V2_FILT: sheet SYSTEM_POWER/AWR_2_1V2_FILT, sheet AWR_2/AWR_1V2
AWR_2_1V8_FILT: sheet SYSTEM_POWER/AWR_2_1V8_FILT, sheet AWR_2/AWR_1V8
AWR_2_BSS_LOGGER: sheet HOST_CONNECTORS/AWR_2_BSS_LOGGER, sheet AWR_2/BSS_LOGGER
AWR_2_CSI2_CLK_N: sheet HOST_CONNECTORS/AWR_2_CSI2_CLK_N, sheet AWR_2/CSI2_CLK_N
AWR_2_CSI2_CLK_P: sheet HOST_CONNECTORS/AWR_2_CSI2_CLK_P, sheet AWR_2/CSI2_CLK_P
AWR_2_CSI2_TX0_N: sheet HOST_CONNECTORS/AWR_2_CSI2_TX0_N, sheet AWR_2/CSI2_TX0_N
AWR_2_CSI2_TX0_P: sheet HOST_CONNECTORS/AWR_2_CSI2_TX0_P, sheet AWR_2/CSI2_TX0_P
AWR_2_CSI2_TX1_N: sheet HOST_CONNECTORS/AWR_2_CSI2_TX1_N, sheet AWR_2/CSI2_TX1_N
AWR_2_CSI2_TX1_P: sheet HOST_CONNECTORS/AWR_2_CSI2_TX1_P, sheet AWR_2/CSI2_TX1_P
AWR_2_CSI2_TX2_N: sheet HOST_CONNECTORS/AWR_2_CSI2_TX2_N, sheet AWR_2/CSI2_TX2_N
AWR_2_CSI2_TX2_P: sheet HOST_CONNECTORS/AWR_2_CSI2_TX2_P, sheet AWR_2/CSI2_TX2_P
AWR_2_CSI2_TX3_N: sheet HOST_CONNECTORS/AWR_2_CSI2_TX3_N, sheet AWR_2/CSI2_TX3_N
AWR_2_CSI2_TX3_P: sheet HOST_CONNECTORS/AWR_2_CSI2_TX3_P, sheet AWR_2/CSI2_TX3_P
AWR_2_DIG_SYNCIN: sheet DIG_SYNC_LO_20GHZ/AWR_2_DIG_SYNCIN, sheet AWR_2/DIG_SYNCIN, sheet AWR_2/DIG_SYNCIN
AWR_2_DIG_SYNCOUT: sheet HOST_CONNECTORS/AWR_2_DIG_SYNCOUT, sheet AWR_2/DIG_SYNCOUT
AWR_2_FMCW_CLKOUT: sheet SYSTEM_TEST_CONN_TERMINATION/AWR_2_FMCW_CLKOUT, sheet AWR_2/FMCW_CLKOUT
AWR_2_FMCW_SYNCOUT: sheet SYSTEM_TEST_CONN_TERMINATION/AWR_2_FMCW_SYNCOUT, sheet AWR_2/FMCW_SYNCOUT
AWR_2_GPIO_0: sheet HOST_CONNECTORS/AWR_2_GPIO_0, sheet AWR_2/GPIO_0
AWR_2_GPIO_1: sheet HOST_CONNECTORS/AWR_2_GPIO_1, sheet AWR_2/GPIO_1
AWR_2_GPIO_2: sheet HOST_CONNECTORS/AWR_2_GPIO_2, sheet AWR_2/GPIO_2
AWR_2_LVDS_FRCLK_N: sheet HOST_CONNECTORS/AWR_2_LVDS_FRCLK_N, sheet AWR_2/LVDS_FRCLK_N
AWR_2_LVDS_FRCLK_P: sheet HOST_CONNECTORS/AWR_2_LVDS_FRCLK_P, sheet AWR_2/LVDS_FRCLK_P
AWR_2_LVDS_VALID_N: sheet HOST_CONNECTORS/AWR_2_LVDS_VALID_N, sheet AWR_2/LVDS_VALID_N
AWR_2_LVDS_VALID_P: sheet HOST_CONNECTORS/AWR_2_LVDS_VALID_P, sheet AWR_2/LVDS_VALID_P
AWR_2_MCU_CLKOUT: sheet AWR_2/MCU_CLKOUT
AWR_2_MSS_LOGGER: sheet HOST_CONNECTORS/AWR_2_MSS_LOGGER, sheet AWR_2/MSS_LOGGER
AWR_2_NERROR_IN: sheet AWR_2/NERROR_IN, sheet AWR_2/NERROR_IN
AWR_2_NERROR_OUT: sheet HOST_CONNECTORS/AWR_2_NERROR_OUT, sheet AWR_2/NERROR_OUT
AWR_2_NRST: sheet SYSTEM_POWER/AWR_2_NRST, sheet SYSTEM_LED_INDICATORS/AWR_2_NRST, sheet AWR_2/NRST
AWR_2_NRST_HOST: sheet SYSTEM_POWER/AWR_2_NRST_HOST, sheet HOST_CONNECTORS/AWR_2_NRST
AWR_2_OSC_CLKOUT: sheet SYSTEM_TEST_CONN_TERMINATION/AWR_2_OSC_CLKOUT, sheet AWR_2/OSC_CLKOUT
AWR_2_PMIC_CLKOUT: sheet HOST_CONNECTORS/AWR_2_PMIC_CLKOUT, sheet AWR_2/PMIC_CLKOUT
AWR_2_SCL: sheet HOST_CONNECTORS/AWR_2_SCL, sheet AWR_2/SCL, sheet AWR_2/SCL
AWR_2_SDA: sheet HOST_CONNECTORS/AWR_2_SDA, sheet AWR_2/SDA, sheet AWR_2/SDA
AWR_2_SPI_CLK1: sheet HOST_CONNECTORS/AWR_2_SPI_CLK1, sheet AWR_2/SPI_CLK1, sheet AWR_2/SPI_CLK1
AWR_2_SPI_CS1: sheet HOST_CONNECTORS/AWR_2_SPI_CS1, sheet AWR_2/SPI_CS1, sheet AWR_2/SPI_CS1
AWR_2_SPI_HOST_INTR1: sheet HOST_CONNECTORS/AWR_2_SPI_HOST_INTR1, sheet AWR_2/SPI_HOST_INTR1, sheet AWR_2/SPI_HOST_INTR1
AWR_2_SPI_MISO1: sheet HOST_CONNECTORS/AWR_2_SPI_MISO1, sheet AWR_2/SPI_MISO1, sheet AWR_2/SPI_MISO1
AWR_2_SPI_MOSI1: sheet HOST_CONNECTORS/AWR_2_SPI_MOSI1, sheet AWR_2/SPI_MOSI1, sheet AWR_2/SPI_MOSI1
AWR_2_TCK: sheet HOST_CONNECTORS/AWR_2_TCK, sheet AWR_2/TCK
AWR_2_TDI: sheet HOST_CONNECTORS/AWR_2_TDI, sheet AWR_2/TDI
AWR_2_TDO: sheet HOST_CONNECTORS/AWR_2_TDO, sheet AWR_2/TDO
AWR_2_TMS: sheet HOST_CONNECTORS/AWR_2_TMS, sheet AWR_2/TMS
AWR_2_UART_RX: sheet HOST_CONNECTORS/AWR_2_UART_RX, sheet AWR_2/UART_RX, sheet AWR_2/UART_RX
AWR_2_UART_TX: sheet HOST_CONNECTORS/AWR_2_UART_TX, sheet AWR_2/UART_TX, sheet AWR_2/UART_TX
AWR_2_WARM_RST: sheet HOST_CONNECTORS/AWR_2_WARM_RST, sheet AWR_2/WARM_RST, sheet AWR_2/WARM_RST
AWR_2_XTAL_CLKM: sheet 40MHZ_CLOCK/AWR_2_XTALM, sheet AWR_2/XTAL_CLKM
AWR_2_XTAL_CLKP: sheet 40MHZ_CLOCK/AWR_2_XTALP, sheet AWR_2/XTAL_CLKP
AWR_3_1V0_RF1_FILT: sheet SYSTEM_POWER/AWR_3_1V0_RF1_FILT, sheet AWR_3/AWR_1V0_RF1
AWR_3_1V0_RF2_FILT: sheet SYSTEM_POWER/AWR_3_1V0_RF2_FILT, sheet AWR_3/AWR_1V0_RF2, sheet AWR_3/AWR_1V0_RF2
AWR_3_1V2_FILT: sheet SYSTEM_POWER/AWR_3_1V2_FILT, sheet AWR_3/AWR_1V2
AWR_3_1V8_FILT: sheet SYSTEM_POWER/AWR_3_1V8_FILT, sheet AWR_3/AWR_1V8
AWR_3_BSS_LOGGER: sheet HOST_CONNECTORS/AWR_3_BSS_LOGGER, sheet AWR_3/BSS_LOGGER
AWR_3_CSI2_CLK_N: sheet HOST_CONNECTORS/AWR_3_CSI2_CLK_N, sheet AWR_3/CSI2_CLK_N
AWR_3_CSI2_CLK_P: sheet HOST_CONNECTORS/AWR_3_CSI2_CLK_P, sheet AWR_3/CSI2_CLK_P
AWR_3_CSI2_TX0_N: sheet HOST_CONNECTORS/AWR_3_CSI2_TX0_N, sheet AWR_3/CSI2_TX0_N
AWR_3_CSI2_TX0_P: sheet HOST_CONNECTORS/AWR_3_CSI2_TX0_P, sheet AWR_3/CSI2_TX0_P
AWR_3_CSI2_TX1_N: sheet HOST_CONNECTORS/AWR_3_CSI2_TX1_N, sheet AWR_3/CSI2_TX1_N
AWR_3_CSI2_TX1_P: sheet HOST_CONNECTORS/AWR_3_CSI2_TX1_P, sheet AWR_3/CSI2_TX1_P
AWR_3_CSI2_TX2_N: sheet HOST_CONNECTORS/AWR_3_CSI2_TX2_N, sheet AWR_3/CSI2_TX2_N
AWR_3_CSI2_TX2_P: sheet HOST_CONNECTORS/AWR_3_CSI2_TX2_P, sheet AWR_3/CSI2_TX2_P
AWR_3_CSI2_TX3_N: sheet HOST_CONNECTORS/AWR_3_CSI2_TX3_N, sheet AWR_3/CSI2_TX3_N
AWR_3_CSI2_TX3_P: sheet HOST_CONNECTORS/AWR_3_CSI2_TX3_P, sheet AWR_3/CSI2_TX3_P
AWR_3_DIG_SYNCIN: sheet DIG_SYNC_LO_20GHZ/AWR_3_DIG_SYNCIN, sheet AWR_3/DIG_SYNCIN, sheet AWR_3/DIG_SYNCIN
AWR_3_DIG_SYNCOUT: sheet HOST_CONNECTORS/AWR_3_DIG_SYNCOUT, sheet AWR_3/DIG_SYNCOUT
AWR_3_FMCW_CLKOUT: sheet SYSTEM_TEST_CONN_TERMINATION/AWR_3_FMCW_CLKOUT, sheet AWR_3/FMCW_CLKOUT
AWR_3_FMCW_SYNCOUT: sheet SYSTEM_TEST_CONN_TERMINATION/AWR_3_FMCW_SYNCOUT, sheet AWR_3/FMCW_SYNCOUT
AWR_3_GPIO_0: sheet HOST_CONNECTORS/AWR_3_GPIO_0, sheet AWR_3/GPIO_0
AWR_3_GPIO_1: sheet HOST_CONNECTORS/AWR_3_GPIO_1, sheet AWR_3/GPIO_1
AWR_3_GPIO_2: sheet HOST_CONNECTORS/AWR_3_GPIO_2, sheet AWR_3/GPIO_2
AWR_3_LVDS_FRCLK_N: sheet HOST_CONNECTORS/AWR_3_LVDS_FRCLK_N, sheet AWR_3/LVDS_FRCLK_N
AWR_3_LVDS_FRCLK_P: sheet HOST_CONNECTORS/AWR_3_LVDS_FRCLK_P, sheet AWR_3/LVDS_FRCLK_P
AWR_3_LVDS_VALID_N: sheet HOST_CONNECTORS/AWR_3_LVDS_VALID_N, sheet AWR_3/LVDS_VALID_N
AWR_3_LVDS_VALID_P: sheet HOST_CONNECTORS/AWR_3_LVDS_VALID_P, sheet AWR_3/LVDS_VALID_P
AWR_3_MCU_CLKOUT: sheet 40MHZ_CLOCK/AWR_3_MCU_CLKOUT, sheet AWR_3/MCU_CLKOUT
AWR_3_MSS_LOGGER: sheet HOST_CONNECTORS/AWR_3_MSS_LOGGER, sheet AWR_3/MSS_LOGGER
AWR_3_NERROR_IN: sheet AWR_3/NERROR_IN, sheet AWR_3/NERROR_IN
AWR_3_NERROR_OUT: sheet HOST_CONNECTORS/AWR_3_NERROR_OUT, sheet AWR_3/NERROR_OUT
AWR_3_NRST: sheet SYSTEM_POWER/AWR_3_NRST, sheet SYSTEM_LED_INDICATORS/AWR_3_NRST, sheet AWR_3/NRST
AWR_3_NRST_HOST: sheet SYSTEM_POWER/AWR_3_NRST_HOST, sheet HOST_CONNECTORS/AWR_3_NRST
AWR_3_OSC_CLKOUT: sheet 40MHZ_CLOCK/AWR_3_OSC_CLKOUT, sheet SYSTEM_TEST_CONN_TERMINATION/AWR_3_OSC_CLKOUT, sheet AWR_3/OSC_CLKOUT
AWR_3_PMIC_CLKOUT: sheet SYSTEM_POWER/PMIC2_CLKIN, sheet HOST_CONNECTORS/AWR_3_PMIC_CLKOUT, sheet AWR_3/PMIC_CLKOUT
AWR_3_SCL: sheet HOST_CONNECTORS/AWR_3_SCL, sheet AWR_3/SCL, sheet AWR_3/SCL
AWR_3_SDA: sheet HOST_CONNECTORS/AWR_3_SDA, sheet AWR_3/SDA, sheet AWR_3/SDA
AWR_3_SPI_CLK1: sheet HOST_CONNECTORS/AWR_3_SPI_CLK1, sheet AWR_3/SPI_CLK1, sheet AWR_3/SPI_CLK1
AWR_3_SPI_CS1: sheet HOST_CONNECTORS/AWR_3_SPI_CS1, sheet AWR_3/SPI_CS1, sheet AWR_3/SPI_CS1
AWR_3_SPI_HOST_INTR1: sheet HOST_CONNECTORS/AWR_3_SPI_HOST_INTR1, sheet AWR_3/SPI_HOST_INTR1, sheet AWR_3/SPI_HOST_INTR1
AWR_3_SPI_MISO1: sheet HOST_CONNECTORS/AWR_3_SPI_MISO1, sheet AWR_3/SPI_MISO1, sheet AWR_3/SPI_MISO1
AWR_3_SPI_MOSI1: sheet HOST_CONNECTORS/AWR_3_SPI_MOSI1, sheet AWR_3/SPI_MOSI1, sheet AWR_3/SPI_MOSI1
AWR_3_TCK: sheet HOST_CONNECTORS/AWR_3_TCK, sheet AWR_3/TCK
AWR_3_TDI: sheet HOST_CONNECTORS/AWR_3_TDI, sheet AWR_3/TDI
AWR_3_TDO: sheet HOST_CONNECTORS/AWR_3_TDO, sheet AWR_3/TDO
AWR_3_TMS: sheet HOST_CONNECTORS/AWR_3_TMS, sheet AWR_3/TMS
AWR_3_UART_RX: sheet HOST_CONNECTORS/AWR_3_UART_RX, sheet AWR_3/UART_RX, sheet AWR_3/UART_RX
AWR_3_UART_TX: sheet HOST_CONNECTORS/AWR_3_UART_TX, sheet AWR_3/UART_TX, sheet AWR_3/UART_TX
AWR_3_WARM_RST: sheet HOST_CONNECTORS/AWR_3_WARM_RST, sheet AWR_3/WARM_RST, sheet AWR_3/WARM_RST
AWR_3_XTAL_CLKM: sheet 40MHZ_CLOCK/AWR_3_XTALM, sheet AWR_3/XTAL_CLKM
AWR_3_XTAL_CLKP: sheet 40MHZ_CLOCK/AWR_3_XTALP, sheet AWR_3/XTAL_CLKP
AWR_4_1V0_RF1_FILT: sheet SYSTEM_POWER/AWR_4_1V0_RF1_FILT, sheet AWR_4/AWR_1V0_RF1
AWR_4_1V0_RF2_FILT: sheet SYSTEM_POWER/AWR_4_1V0_RF2_FILT, sheet AWR_4/AWR_1V0_RF2, sheet AWR_4/AWR_1V0_RF2
AWR_4_1V2_FILT: sheet SYSTEM_POWER/AWR_4_1V2_FILT, sheet AWR_4/AWR_1V2
AWR_4_1V8_FILT: sheet SYSTEM_POWER/AWR_4_1V8_FILT, sheet AWR_4/AWR_1V8
AWR_4_BSS_LOGGER: sheet HOST_CONNECTORS/AWR_4_BSS_LOGGER, sheet AWR_4/BSS_LOGGER
AWR_4_CSI2_CLK_N: sheet HOST_CONNECTORS/AWR_4_CSI2_CLK_N, sheet AWR_4/CSI2_CLK_N
AWR_4_CSI2_CLK_P: sheet HOST_CONNECTORS/AWR_4_CSI2_CLK_P, sheet AWR_4/CSI2_CLK_P
AWR_4_CSI2_TX0_N: sheet HOST_CONNECTORS/AWR_4_CSI2_TX0_N, sheet AWR_4/CSI2_TX0_N
AWR_4_CSI2_TX0_P: sheet HOST_CONNECTORS/AWR_4_CSI2_TX0_P, sheet AWR_4/CSI2_TX0_P
AWR_4_CSI2_TX1_N: sheet HOST_CONNECTORS/AWR_4_CSI2_TX1_N, sheet AWR_4/CSI2_TX1_N
AWR_4_CSI2_TX1_P: sheet HOST_CONNECTORS/AWR_4_CSI2_TX1_P, sheet AWR_4/CSI2_TX1_P
AWR_4_CSI2_TX2_N: sheet HOST_CONNECTORS/AWR_4_CSI2_TX2_N, sheet AWR_4/CSI2_TX2_N
AWR_4_CSI2_TX2_P: sheet HOST_CONNECTORS/AWR_4_CSI2_TX2_P, sheet AWR_4/CSI2_TX2_P
AWR_4_CSI2_TX3_N: sheet HOST_CONNECTORS/AWR_4_CSI2_TX3_N, sheet AWR_4/CSI2_TX3_N
AWR_4_CSI2_TX3_P: sheet HOST_CONNECTORS/AWR_4_CSI2_TX3_P, sheet AWR_4/CSI2_TX3_P
AWR_4_DIG_SYNCIN: sheet DIG_SYNC_LO_20GHZ/AWR_4_DIG_SYNCIN, sheet AWR_4/DIG_SYNCIN, sheet AWR_4/DIG_SYNCIN
AWR_4_DIG_SYNCOUT: sheet HOST_CONNECTORS/AWR_4_DIG_SYNCOUT, sheet AWR_4/DIG_SYNCOUT
AWR_4_FMCW_CLKOUT: sheet SYSTEM_TEST_CONN_TERMINATION/AWR_4_FMCW_CLKOUT, sheet AWR_4/FMCW_CLKOUT
AWR_4_FMCW_SYNCOUT: sheet SYSTEM_TEST_CONN_TERMINATION/AWR_4_FMCW_SYNCOUT, sheet AWR_4/FMCW_SYNCOUT
AWR_4_GPIO_0: sheet HOST_CONNECTORS/AWR_4_GPIO_0, sheet AWR_4/GPIO_0
AWR_4_GPIO_1: sheet HOST_CONNECTORS/AWR_4_GPIO_1, sheet AWR_4/GPIO_1
AWR_4_GPIO_2: sheet HOST_CONNECTORS/AWR_4_GPIO_2, sheet AWR_4/GPIO_2
AWR_4_LVDS_FRCLK_N: sheet HOST_CONNECTORS/AWR_4_LVDS_FRCLK_N, sheet AWR_4/LVDS_FRCLK_N
AWR_4_LVDS_FRCLK_P: sheet HOST_CONNECTORS/AWR_4_LVDS_FRCLK_P, sheet AWR_4/LVDS_FRCLK_P
AWR_4_LVDS_VALID_N: sheet HOST_CONNECTORS/AWR_4_LVDS_VALID_N, sheet AWR_4/LVDS_VALID_N
AWR_4_LVDS_VALID_P: sheet HOST_CONNECTORS/AWR_4_LVDS_VALID_P, sheet AWR_4/LVDS_VALID_P
AWR_4_MCU_CLKOUT: sheet AWR_4/MCU_CLKOUT
AWR_4_MSS_LOGGER: sheet HOST_CONNECTORS/AWR_4_MSS_LOGGER, sheet AWR_4/MSS_LOGGER
AWR_4_NERROR_IN: sheet AWR_4/NERROR_IN, sheet AWR_4/NERROR_IN
AWR_4_NERROR_OUT: sheet HOST_CONNECTORS/AWR_4_NERROR_OUT, sheet AWR_4/NERROR_OUT
AWR_4_NRST: sheet SYSTEM_POWER/AWR_4_NRST, sheet SYSTEM_LED_INDICATORS/AWR_4_NRST, sheet AWR_4/NRST
AWR_4_NRST_HOST: sheet SYSTEM_POWER/AWR_4_NRST_HOST, sheet HOST_CONNECTORS/AWR_4_NRST
AWR_4_OSC_CLKOUT: sheet SYSTEM_TEST_CONN_TERMINATION/AWR_4_OSC_CLKOUT, sheet AWR_4/OSC_CLKOUT
AWR_4_PMIC_CLKOUT: sheet HOST_CONNECTORS/AWR_4_PMIC_CLKOUT, sheet AWR_4/PMIC_CLKOUT
AWR_4_SCL: sheet HOST_CONNECTORS/AWR_4_SCL, sheet AWR_4/SCL, sheet AWR_4/SCL
AWR_4_SDA: sheet HOST_CONNECTORS/AWR_4_SDA, sheet AWR_4/SDA, sheet AWR_4/SDA
AWR_4_SPI_CLK1: sheet HOST_CONNECTORS/AWR_4_SPI_CLK1, sheet AWR_4/SPI_CLK1, sheet AWR_4/SPI_CLK1
AWR_4_SPI_CS1: sheet HOST_CONNECTORS/AWR_4_SPI_CS1, sheet AWR_4/SPI_CS1, sheet AWR_4/SPI_CS1
AWR_4_SPI_HOST_INTR1: sheet HOST_CONNECTORS/AWR_4_SPI_HOST_INTR1, sheet AWR_4/SPI_HOST_INTR1, sheet AWR_4/SPI_HOST_INTR1
AWR_4_SPI_MISO1: sheet HOST_CONNECTORS/AWR_4_SPI_MISO1, sheet AWR_4/SPI_MISO1, sheet AWR_4/SPI_MISO1
AWR_4_SPI_MOSI1: sheet HOST_CONNECTORS/AWR_4_SPI_MOSI1, sheet AWR_4/SPI_MOSI1, sheet AWR_4/SPI_MOSI1
AWR_4_TCK: sheet HOST_CONNECTORS/AWR_4_TCK, sheet AWR_4/TCK
AWR_4_TDI: sheet HOST_CONNECTORS/AWR_4_TDI, sheet AWR_4/TDI
AWR_4_TDO: sheet HOST_CONNECTORS/AWR_4_TDO, sheet AWR_4/TDO
AWR_4_TMS: sheet HOST_CONNECTORS/AWR_4_TMS, sheet AWR_4/TMS
AWR_4_UART_RX: sheet HOST_CONNECTORS/AWR_4_UART_RX, sheet AWR_4/UART_RX, sheet AWR_4/UART_RX
AWR_4_UART_TX: sheet HOST_CONNECTORS/AWR_4_UART_TX, sheet AWR_4/UART_TX, sheet AWR_4/UART_TX
AWR_4_WARM_RST: sheet HOST_CONNECTORS/AWR_4_WARM_RST, sheet AWR_4/WARM_RST, sheet AWR_4/WARM_RST
AWR_4_XTAL_CLKM: sheet 40MHZ_CLOCK/AWR_4_XTALM, sheet AWR_4/XTAL_CLKM
AWR_4_XTAL_CLKP: sheet 40MHZ_CLOCK/AWR_4_XTALP, sheet AWR_4/XTAL_CLKP
EXT_40MHZ_CLK_1V8: sheet 40MHZ_CLOCK/EXT_40MHZ_BUFF_1V8_PRI, sheet HOST_CONNECTORS/EXT_40MHZ_CLK_1V8
EXT_DIG_SYNC: sheet DIG_SYNC_LO_20GHZ/EXT_DIG_SYNC, sheet HOST_CONNECTORS/EXT_DIG_SYNC
NERROR_OUT: sheet SYSTEM_LED_INDICATORS/NERROR_OUT, sheet HOST_CONNECTORS/NERROR_OUT
PMIC1_SCL: sheet HOST_CONNECTORS/PMIC1_SCL, sheet SYSTEM_POWER/PMIC1_I2C.PMIC1_SCL
PMIC1_SDA: sheet HOST_CONNECTORS/PMIC1_SDA, sheet SYSTEM_POWER/PMIC1_I2C.PMIC1_SDA
PMIC2_TMPSNS_SCL: sheet SYSTEM_TEMP_SENSORS/PMIC2_TMPSNS_SCL, sheet HOST_CONNECTORS/PMIC2_TMPSNS_SCL, sheet SYSTEM_POWER/PMIC2_I2C.PMIC2_SCL
PMIC2_TMPSNS_SDA: sheet SYSTEM_TEMP_SENSORS/PMIC2_TMPSNS_SDA, sheet HOST_CONNECTORS/PMIC2_TMPSNS_SDA, sheet SYSTEM_POWER/PMIC2_I2C.PMIC2_SDA
PMIC_BUCK_EN: sheet SYSTEM_POWER/PMIC_BUCK_EN, sheet HOST_CONNECTORS/PMIC_BUCKEN
PMIC_NRST: sheet SYSTEM_POWER/PMIC_NRST, sheet HOST_CONNECTORS/PMIC_NRST
SYSTEM_PGOOD: sheet SYSTEM_POWER/SYSTEM_PGOOD, sheet HOST_CONNECTORS/SYSTEM_PGOOD
TMPSNS_ALERT: sheet SYSTEM_TEMP_SENSORS/TMPSNS_ALERT, sheet HOST_CONNECTORS/TMPSNS_ALERT

### Notes on the sheet
- Cascade Radar RF Board  - Top Level Schematic
- AWR_1 (Master)
- AWR_3 (Slave)
- System Power/Reset
- 40MHz Generation/Distribution
- Digital Sync and 20GHZ LO
- AWR_2 (Slave)
- AWR_4 (Slave)
- System LED Indicators
- System Temperature Sensors
- System Test Connectors And Termination
- Drawn By:
- SVN Rev:
- Number:
- TID #:
- Orderable:
- Rev:
- Sheet Title:
- File:
- Project Title:
- Designed for:
- Assembly Variant:
- Mod. Date:
- Sheet:
- Size:
- of
- C
- http://www.ti.com
- Texas Instruments and/or its licensors do not warrant the accuracy or completeness of this specification or any information contained therein. Texas Instruments and/or its licensors do not warrant that this design will meet the specifications, will be suitable for your application or fit for any particular purpose, or will operate in an implementation. Texas Instruments and/or its licensors do not warrant that the design is production worthy. You should completely validate and test your design implementation to confirm the system functionality for your application.
- Engineer:
- Contact:
- © Texas Instruments